# Altium schematic sheet v1.1.SchDoc
size 254 x 149 mm
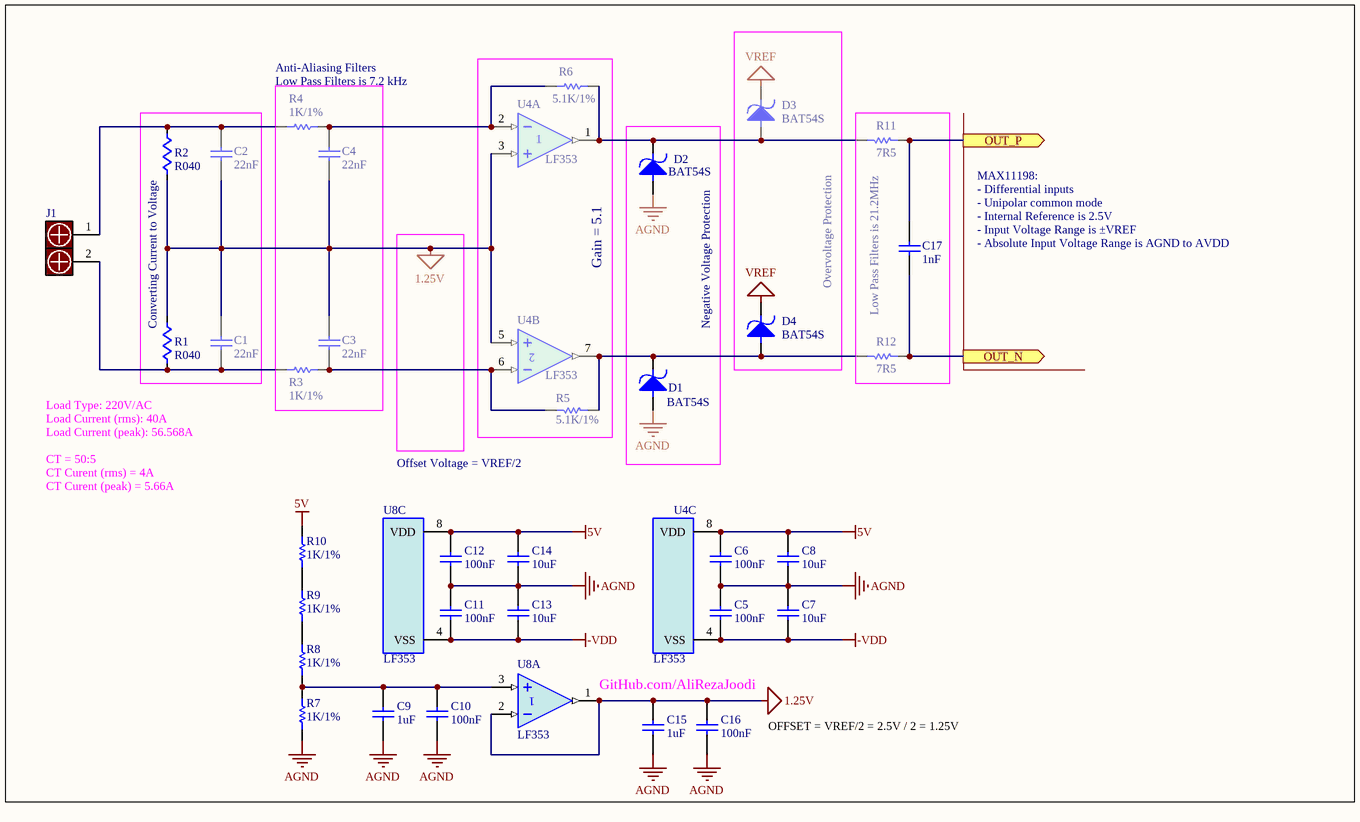
[diagram p0: v1.1.SchDoc]

## Parts
C1  22nF  [SMD_0805]
C2  22nF  [SMD_0805]
C3  22nF  [SMD_0805]
C4  22nF  [SMD_0805]
C5  100nF  [SMD_0805]
C6  100nF  [SMD_0805]
C7  10uF  [SMD_0805]
C8  10uF  [SMD_0805]
C9  1uF  [SMD_0805]
C10  100nF  [SMD_0805]
C11  100nF  [SMD_0805]
C12  100nF  [SMD_0805]
C13  10uF  [SMD_0805]
C14  10uF  [SMD_0805]
C15  1uF  [SMD_0805]
C16  100nF  [SMD_0805]
C17  1nF  [SMD_0805]
D1  BAT54S
D2  BAT54S
D3  BAT54S
D4  BAT54S
J1  (no value)  [1x2_P8.26]
R1  R040  [SMD_4527]
R2  R040  [SMD_4527]
R3  1K/1%  [SMD_0805]
R4  1K/1%  [SMD_0805]
R5  5.1K/1%  [SMD_0805]
R6  5.1K/1%  [SMD_0805]
R7  1K/1%  [SMD_0805]
R8  1K/1%  [SMD_0805]
R9  1K/1%  [SMD_0805]
R10  1K/1%  [SMD_0805]
R11  7R5  [SMD_0805]
R12  7R5  [SMD_0805]
U4  LF353  [SOIC127P600-8CM]  (parts A,B,C of 3)
U8  LF353  [SOIC127P600-8CM]  (parts A,C of 3)

## Blocks framed on the sheet
Gain = 5.1: R5 R6 U4
Overvoltage Protection: D3 D4
Converting Current to Voltage: C1 C2 R1 R2
Low Pass Filters is 21.2MHz: C17 R11 R12
Negative Voltage Protection: D1 D2

## Ports
OUT_N (out), OUT_P (out)

## Nets
1.25V: C1.1 C2.2 C3.1 C4.2 C15.1 C16.2 R1.2 R2.1 U4.3(IN+) U4.5(IN+) U8.1(OUT) U8.2(IN-)
5V: C6.2 C8.1 C12.2 C14.1 R10.1 U4.8(VDD) U8.8(VDD)
-VDD: C5.1 C7.2 C11.1 C13.2 U4.4(VSS) U8.4(VSS)
AGND: C5.2 C6.1 C7.1 C8.2 C9.2 C10.1 C11.2 C12.1 C13.1 C14.2 C15.2 C16.1 D1.1(A) D2.1(A) R7.2
VREF: D3.2(K) D4.2(K)
OUT_N: C17.2 R12.1 ; port OUT_N
OUT_P: C17.1 R11.1 ; port OUT_P
NetC1_2: C1.2 J1.2 R1.1 R3.2
NetC2_1: C2.1 J1.1 R2.2 R4.2
NetC3_2: C3.2 R3.1 R5.2 U4.6(IN-)
NetC4_1: C4.1 R4.1 R6.2 U4.2(IN-)
NetC9_1: C9.1 C10.2 R7.1 R8.2 U8.3(IN+)
NetD1_2: D1.2(K) D4.1(A) R5.1 R12.2 U4.7(OUT)
NetD2_2: D2.2(K) D3.1(A) R6.1 R11.2 U4.1(OUT)
NetR8_1: R8.1 R9.2
NetR9_1: R9.1 R10.2

## Notes on the sheet
- Anti-Aliasing Filters
  Low Pass Filters is 7.2 kHz
- MAX11198:
  - Differential inputs
  - Unipolar common mode
  - Internal Reference is 2.5V
  - Input Voltage Range is ±VREF
  - Absolute Input Voltage Range is AGND to AVDD
- Offset Voltage = VREF/2
- Load Type: 220V/AC
  Load Current (rms): 40A
  Load Current (peak): 56.568A
  CT = 50:5
  CT Curent (rms) = 4A
  CT Curent (peak) = 5.66A
- GitHub.com/AliRezaJoodi
- OFFSET = VREF/2 = 2.5V / 2 = 1.25V

## Library data of the parts
C1-C17 = Capacitor_Ceramic: Capacitor, Ceramic Multilayer, 25V, 10%; Revision: July-2002: Re-released for DXP Platform.
D1-D4 = Diode_Schottky: Diode, Schottky; Revision: July-2002: Re-released for DXP Platform.
J1 = Connector1x2_Power_4Form: Connector, Barrier Terminal Blocks, 2Pin; Manufacturer: TE Connectivity; Part Number: 1977477-2; Link: https://eu.mouser.com/ProductDetail/TE-Connectivity/1977477-2?qs=94mdU9cNTDpZiO77z39FFw%3D%3D
R1 R2 = Resistor_2Form: Resistor, 2W, 1%; 1_Manufacturer: Vishay / Dale; 1_Part Number: WSR2R0400FEA; 1_Link: https://eu.mouser.com/ProductDetail/Vishay-Dale/WSR2R0400FEA?qs=sGAEpiMZZMtlubZbdhIBIMgVGVS%252BbZOAbgAcZFEfOTY%3D
R3-R12 = Resistor: Resistor, 1/8W, 1%; Revision: July-2002: Re-released for DXP Platform.
U4 U8 = Op-Amp_Form1: IC, Op-Amp; Manufacturer: Texas Instruments; Part Number: LF353P; Link: https://eu.mouser.com/ProductDetail/Texas-Instruments/LF353P?qs=EIjG%252BN7kn%252BnHJN43AgArjw%3D%3D